# EAGLE schematic protoCtrl (EAGLE 6.3)
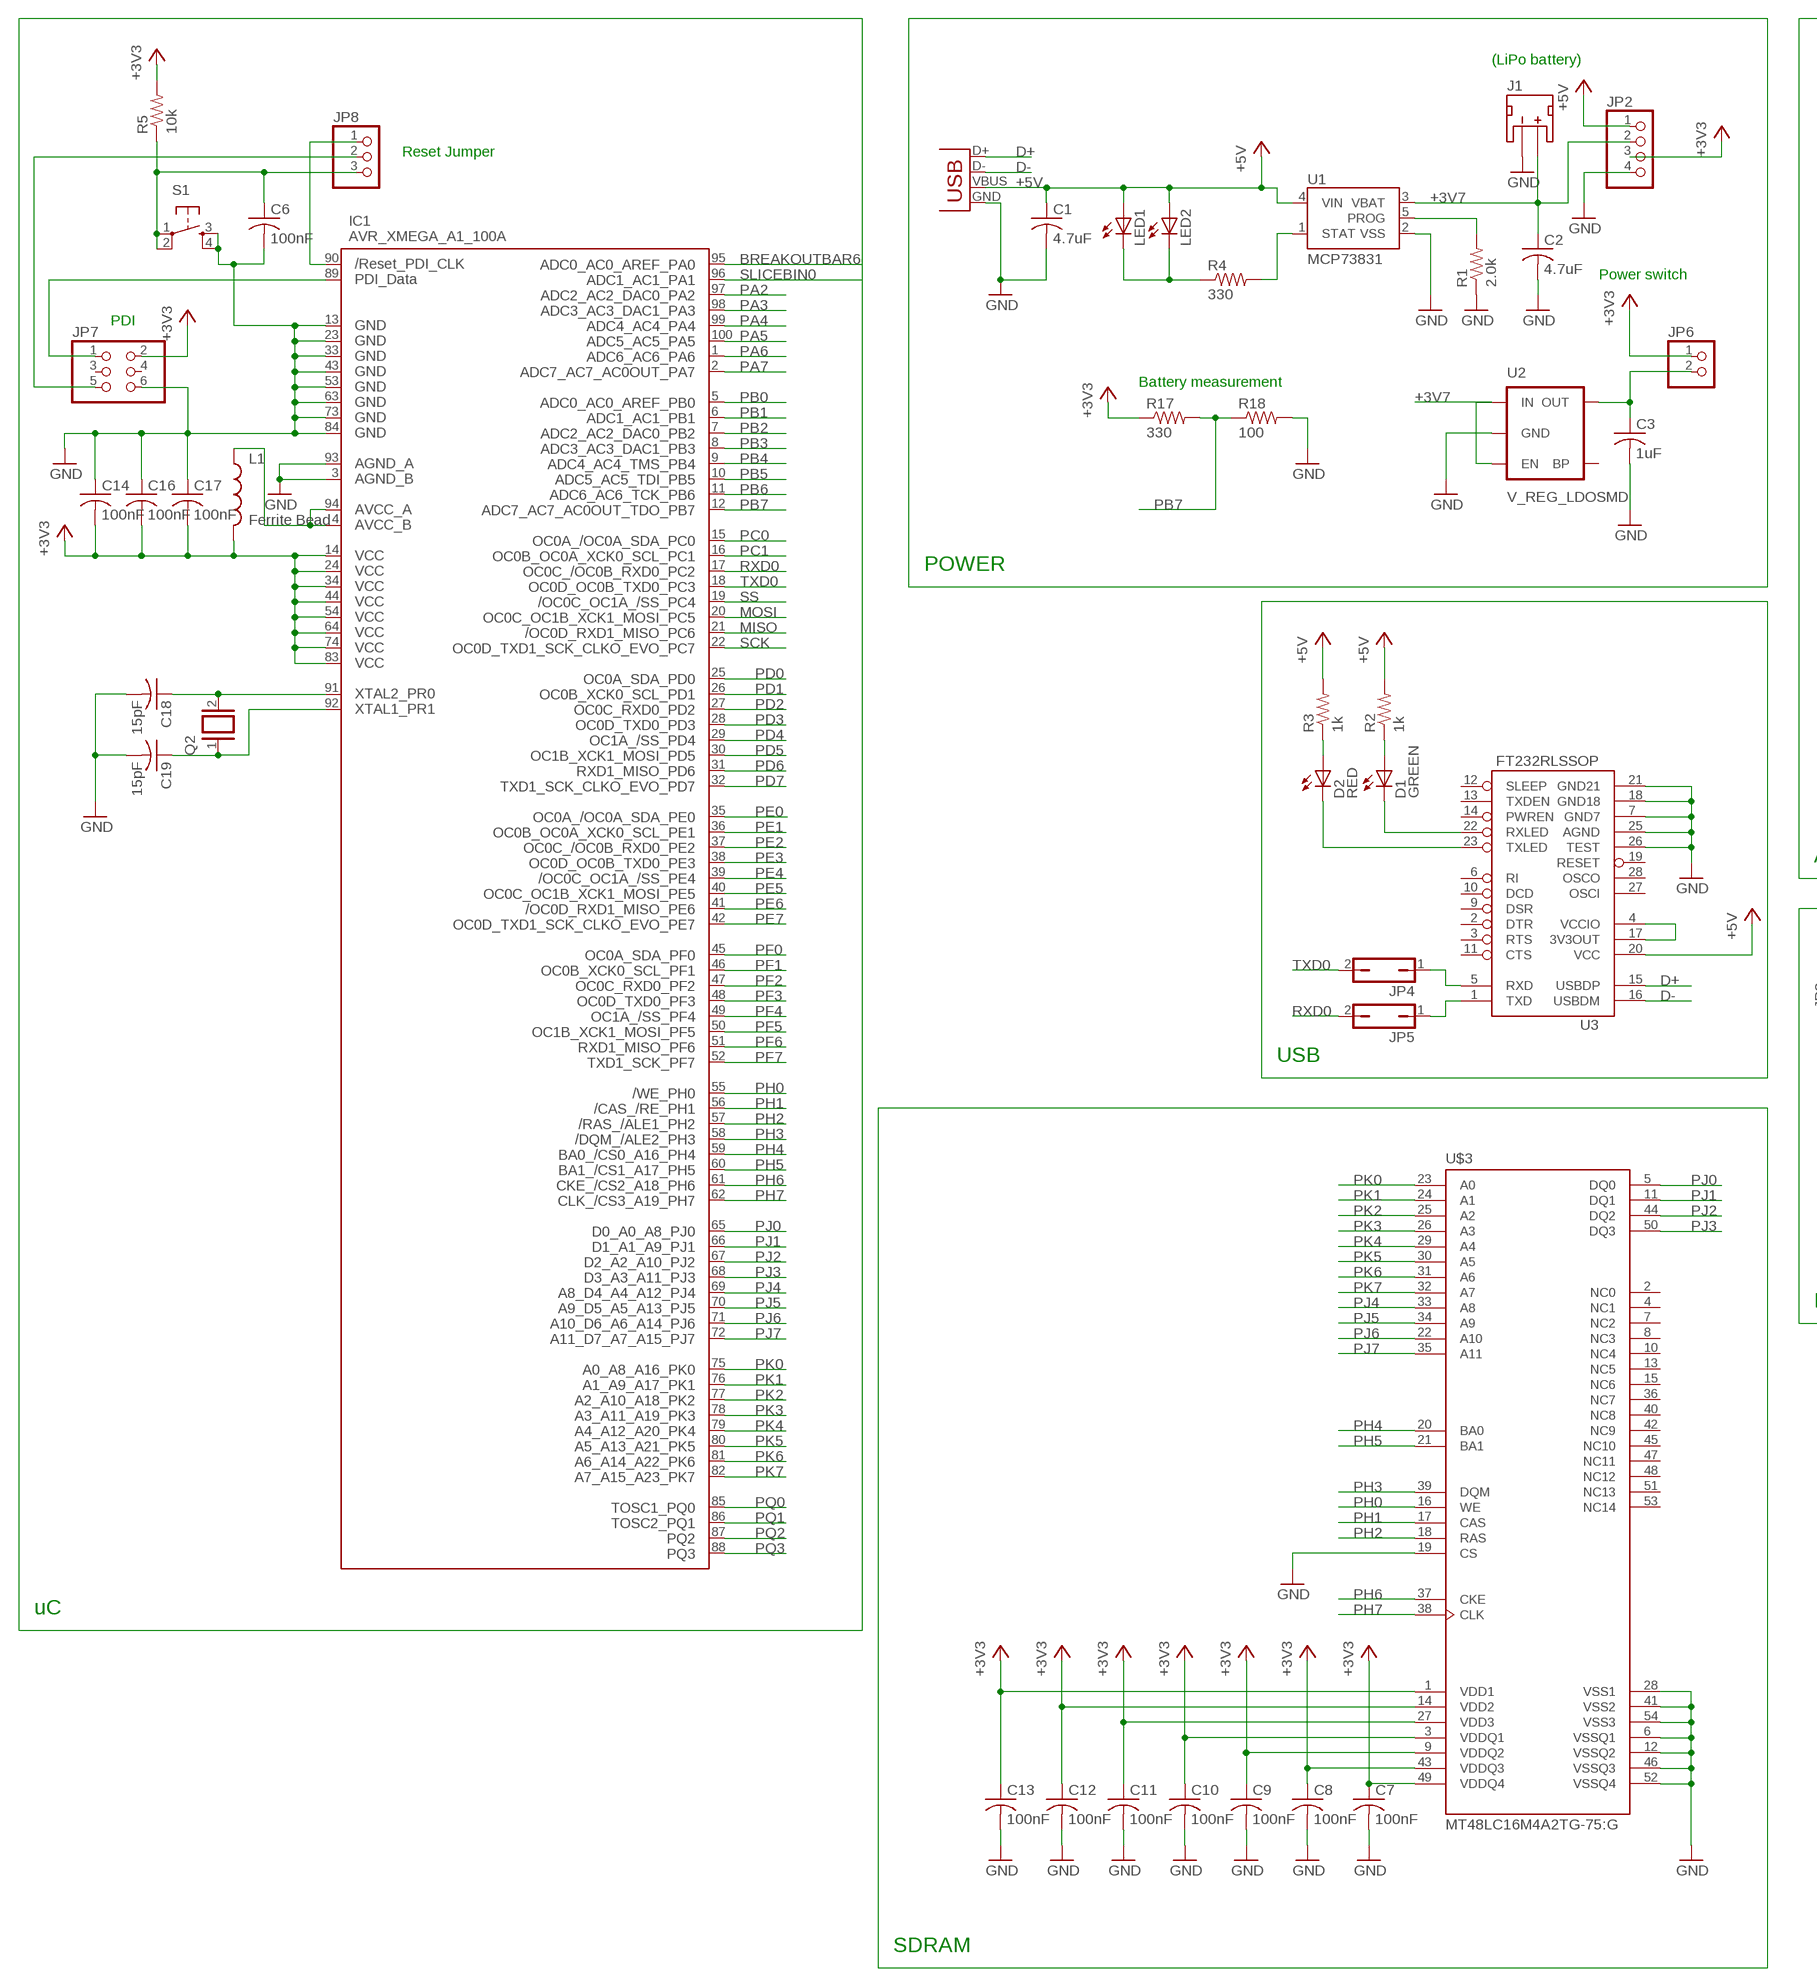
[diagram p0: schematic, sheet 1, part 1 of 2]
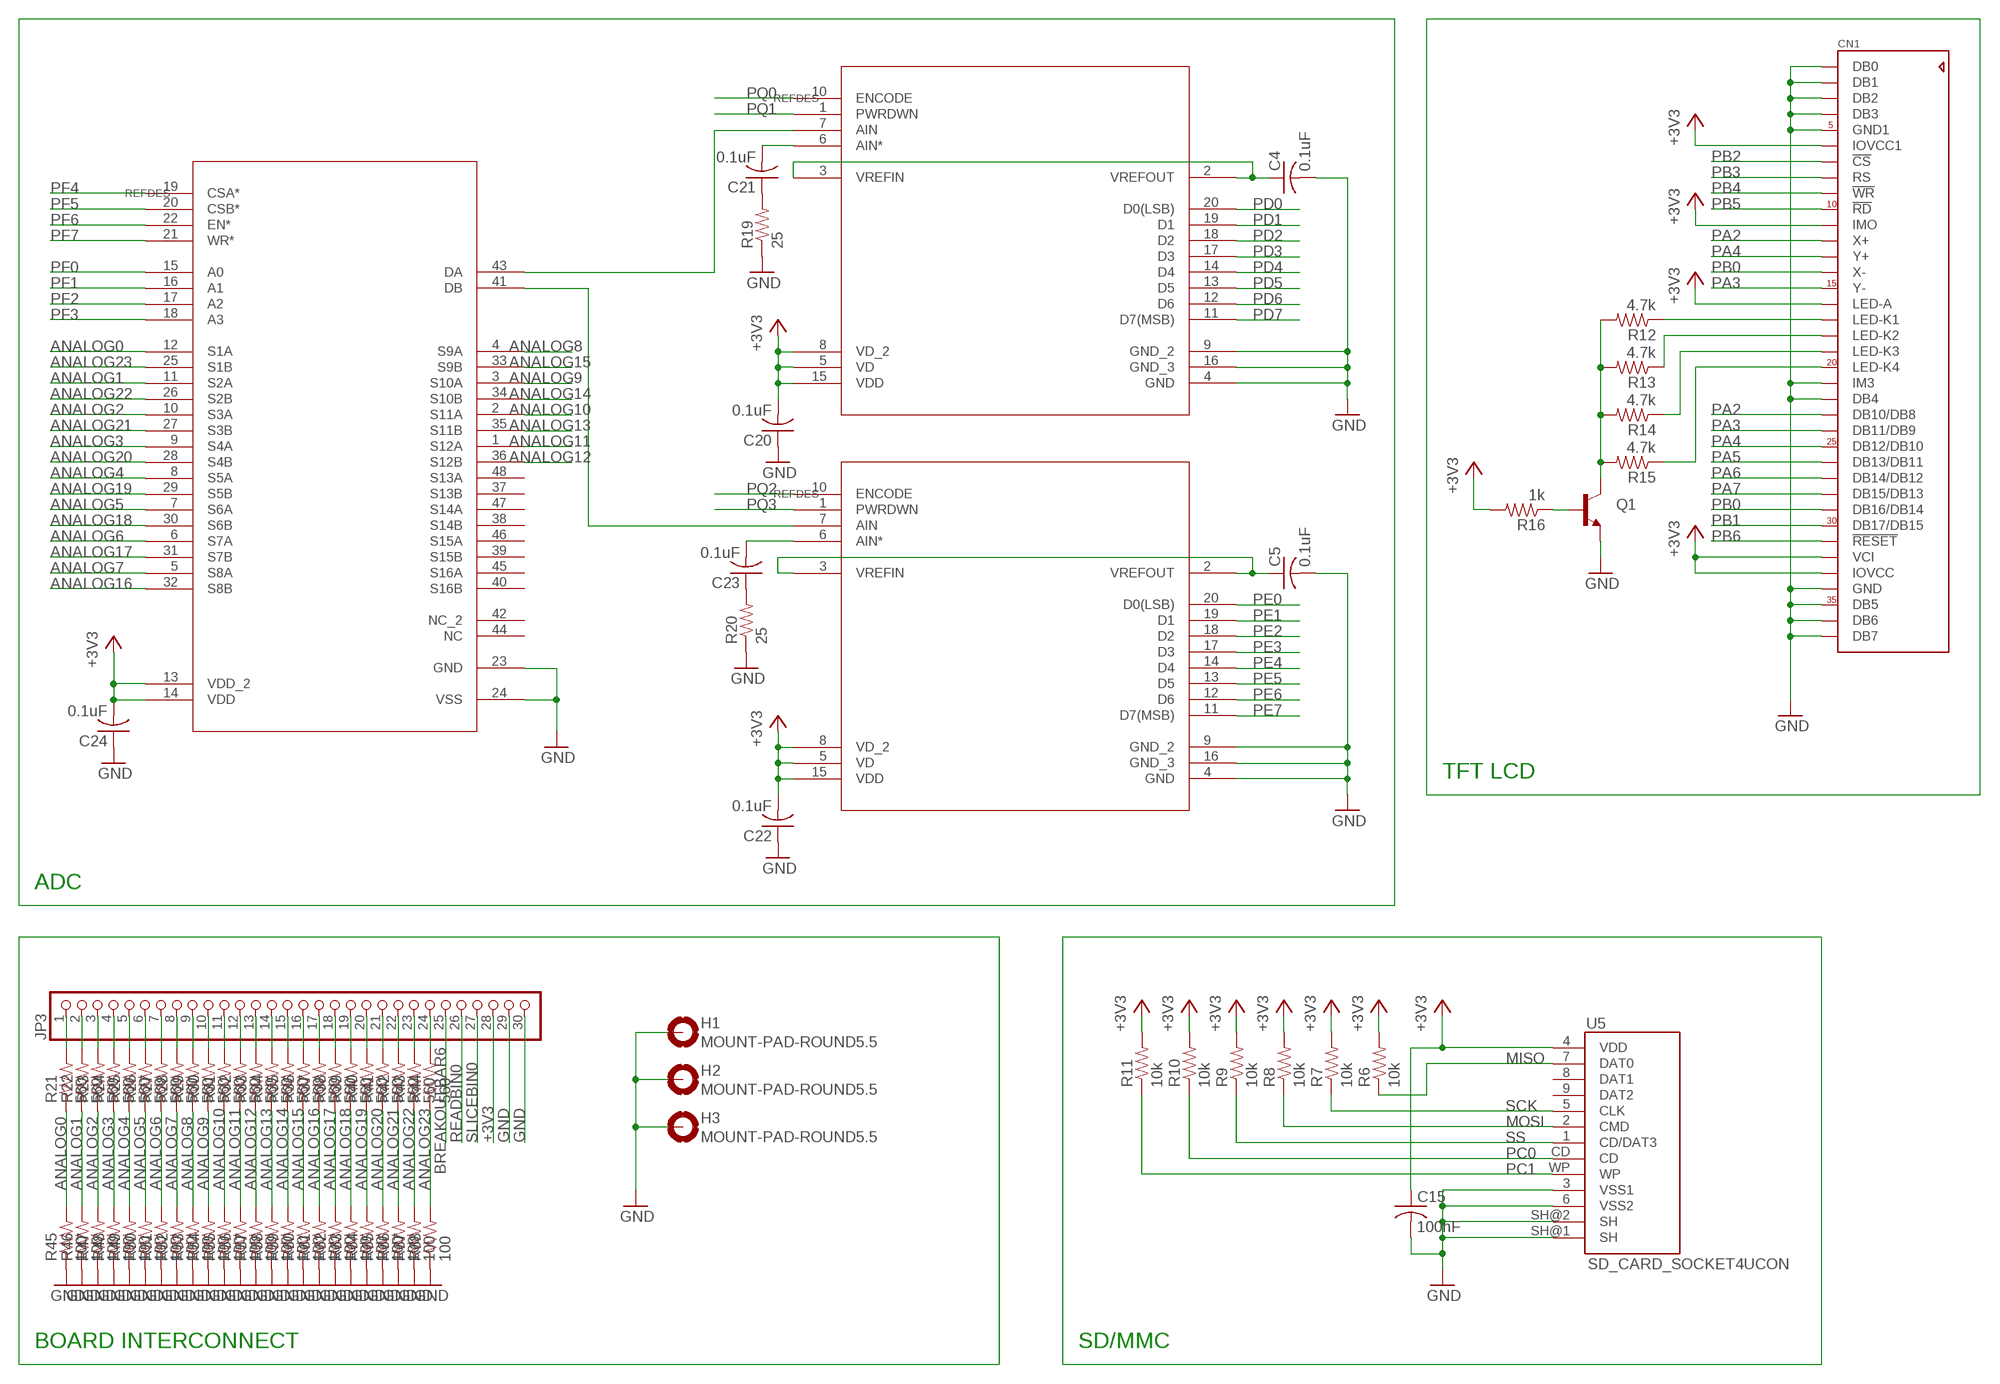
[diagram p1: schematic, sheet 1, part 2 of 2]

## Parts
C1  4.7uF  C-USC0603  [C0603]
C2  4.7uF  C-USC0603  [C0603]
C3  1uF  C-USC0603  [C0603]
C4  0.1uF  C-USC0603  [C0603]
C5  0.1uF  C-USC0603  [C0603]
C6  100nF  C-USC0603  [C0603]
C7  100nF  C-USC0603  [C0603]
C8  100nF  C-USC0603  [C0603]
C9  100nF  C-USC0603  [C0603]
C10  100nF  C-USC0603  [C0603]
C11  100nF  C-USC0603  [C0603]
C12  100nF  C-USC0603  [C0603]
C13  100nF  C-USC0603  [C0603]
C14  100nF  C-USC0603  [C0603]
C15  100nF  C-USC0603  [C0603]
C16  100nF  C-USC0603  [C0603]
C17  100nF  C-USC0603  [C0603]
C18  15pF  C-USC0603  [C0603]
C19  15pF  C-USC0603  [C0603]
C20  0.1uF  C-USC0603  [C0603]
C21  0.1uF  C-USC0603  [C0603]
C22  0.1uF  C-USC0603  [C0603]
C23  0.1uF  C-USC0603  [C0603]
C24  0.1uF  C-USC0603  [C0603]
CN1  ILI9325_LCD1.0MM  [ILI9325_28INCH_TS]
D1  GREEN  LED-GREEN0603  [LED-0603]
D2  RED  LED-RED0603  [LED-0603]
H1  MOUNT-PAD-ROUND5.5  [5,5-PAD]
H2  MOUNT-PAD-ROUND5.5  [5,5-PAD]
H3  MOUNT-PAD-ROUND5.5  [5,5-PAD]
IC1  AVR_XMEGA_A1_100A  [TQFP100]
J1  JST_2MM_MALE  [JST-2-SMD]
JP1  USBSMD  [USB-MINIB]
JP2  PINHD-1X4  [1X04]
JP3  PINHD-1X30  [1X30]
JP4  JP1Q  [JP1]
JP5  JP1Q  [JP1]
JP6  PINHD-1X2  [1X02]
JP7  PINHD-2X3  [2X03]
JP8  PINHD-1X3  [1X03]
L1  Ferrite Bead  INDUCTOR0603  [0603]
LED1  LED1206  [LED-1206]
LED2  LED3MM  [LED3MM]
Q1  TRANSISTOR_NPN"  [SOT223]
Q2  XTAL/S  [QS]
R1  2.0k  2.0KOHM1/10W5%(0603)  [0402-RES]
R2  1k  1K-1%  [0402-RES]
R3  1k  1K-1%  [0402-RES]
R4  330  330OHM1/10W1%(0603)  [0402-RES]
R5  10k  2.0KOHM1/10W5%(0603)  [0402-RES]
R6  10k  2.0KOHM1/10W5%(0603)  [0402-RES]
R7  10k  2.0KOHM1/10W5%(0603)  [0402-RES]
R8  10k  2.0KOHM1/10W5%(0603)  [0402-RES]
R9  10k  2.0KOHM1/10W5%(0603)  [0402-RES]
R10  10k  2.0KOHM1/10W5%(0603)  [0402-RES]
R11  10k  2.0KOHM1/10W5%(0603)  [0402-RES]
R12  4.7k  2.0KOHM1/10W5%(0603)  [0402-RES]
R13  4.7k  2.0KOHM1/10W5%(0603)  [0402-RES]
R14  4.7k  2.0KOHM1/10W5%(0603)  [0402-RES]
R15  4.7k  2.0KOHM1/10W5%(0603)  [0402-RES]
R16  1k  2.0KOHM1/10W5%(0603)  [0402-RES]
R17  330  330OHM1/10W1%(0603)  [0402-RES]
R18  100  330OHM1/10W1%(0603)  [0402-RES]
R19  25  330OHM1/10W1%(0603)  [0402-RES]
R20  25  330OHM1/10W1%(0603)  [0402-RES]
R21  560  330OHM1/10W1%(0603)  [0402-RES]
R22  560  330OHM1/10W1%(0603)  [0402-RES]
R23  560  330OHM1/10W1%(0603)  [0402-RES]
R24  560  330OHM1/10W1%(0603)  [0402-RES]
R25  560  330OHM1/10W1%(0603)  [0402-RES]
R26  560  330OHM1/10W1%(0603)  [0402-RES]
R27  560  330OHM1/10W1%(0603)  [0402-RES]
R28  560  330OHM1/10W1%(0603)  [0402-RES]
R29  560  330OHM1/10W1%(0603)  [0402-RES]
R30  560  330OHM1/10W1%(0603)  [0402-RES]
R31  560  330OHM1/10W1%(0603)  [0402-RES]
R32  560  330OHM1/10W1%(0603)  [0402-RES]
R33  560  330OHM1/10W1%(0603)  [0402-RES]
R34  560  330OHM1/10W1%(0603)  [0402-RES]
R35  560  330OHM1/10W1%(0603)  [0402-RES]
R36  560  330OHM1/10W1%(0603)  [0402-RES]
R37  560  330OHM1/10W1%(0603)  [0402-RES]
R38  560  330OHM1/10W1%(0603)  [0402-RES]
R39  560  330OHM1/10W1%(0603)  [0402-RES]
R40  560  330OHM1/10W1%(0603)  [0402-RES]
R41  560  330OHM1/10W1%(0603)  [0402-RES]
R42  560  330OHM1/10W1%(0603)  [0402-RES]
R43  560  330OHM1/10W1%(0603)  [0402-RES]
R44  560  330OHM1/10W1%(0603)  [0402-RES]
R45  100  330OHM1/10W1%(0603)  [0402-RES]
R46  100  330OHM1/10W1%(0603)  [0402-RES]
R47  100  330OHM1/10W1%(0603)  [0402-RES]
R48  100  330OHM1/10W1%(0603)  [0402-RES]
R49  100  330OHM1/10W1%(0603)  [0402-RES]
R50  100  330OHM1/10W1%(0603)  [0402-RES]
R51  100  330OHM1/10W1%(0603)  [0402-RES]
R52  100  330OHM1/10W1%(0603)  [0402-RES]
R53  100  330OHM1/10W1%(0603)  [0402-RES]
R54  100  330OHM1/10W1%(0603)  [0402-RES]
R55  100  330OHM1/10W1%(0603)  [0402-RES]
R56  100  330OHM1/10W1%(0603)  [0402-RES]
R57  100  330OHM1/10W1%(0603)  [0402-RES]
R58  100  330OHM1/10W1%(0603)  [0402-RES]
R59  100  330OHM1/10W1%(0603)  [0402-RES]
R60  100  330OHM1/10W1%(0603)  [0402-RES]
R61  100  330OHM1/10W1%(0603)  [0402-RES]
R62  100  330OHM1/10W1%(0603)  [0402-RES]
R63  100  330OHM1/10W1%(0603)  [0402-RES]
R64  100  330OHM1/10W1%(0603)  [0402-RES]
R65  100  330OHM1/10W1%(0603)  [0402-RES]
R66  100  330OHM1/10W1%(0603)  [0402-RES]
R67  100  330OHM1/10W1%(0603)  [0402-RES]
R68  100  330OHM1/10W1%(0603)  [0402-RES]
S1  TAC_SWITCHPTH  [TACTILE-PTH]
U1  MCP73831  [SOT23-5]
U2  V_REG_LDOSMD  [SOT23-5]
U3  FT232RLSSOP  [SSOP28DB]
U4  ADG726BSUZ  [SU_48]
U5  SD_CARD_SOCKET4UCON  [SDCARD_4UCONN]
U6  AD9283BRSZ-80REAL  [SSOP20]
U7  AD9283BRSZ-80REAL  [SSOP20]
U$3  MT48LC16M4A2TG-75:G  [TSOP54-400]

## Nets
+3V3: C7.1 C8.1 C9.1 C10.1 C11.1 C12.1 C13.1 C14.2 C15.1 C16.2 C17.2 C20.2 C22.2 C24.2 CN1.6(IOVCC1) CN1.11(IMO) CN1.16(LED-A) CN1.32(VCI) CN1.33(IOVCC) IC1.14(VCC1) IC1.24(VCC2) IC1.34(VCC3) IC1.44(VCC4) IC1.54(VCC5) IC1.64(VCC6) IC1.74(VCC7) IC1.83(VCC8) JP2.3 JP3.28 JP6.1 JP7.2 L1.2 R5.2 R6.2 R7.2 R8.2 R9.2 R10.2 R11.2 R16.2 R17.1 U4.13(VDD_2) U4.14(VDD) U5.4(VDD) U6.5(VD) U6.8(VD_2) U6.15(VDD) U7.5(VD) U7.8(VD_2) U7.15(VDD) U$3.1(VDD1) U$3.3(VDDQ1) U$3.9(VDDQ2) U$3.14(VDD2) U$3.27(VDD3) U$3.43(VDDQ3) U$3.49(VDDQ4)
+3V7: C2.1 J1.2(+) JP2.2 U1.3(VBAT) U2.1(IN) U2.3(EN)
+5V: C1.1 JP1.VBUS JP2.1 LED1.A LED2.A R2.2 R3.2 U1.4(VIN) U3.20(VCC)
ANALOG0: R21.1 R45.2 U4.12(S1A)
ANALOG1: R22.1 R46.2 U4.11(S2A)
ANALOG2: R23.1 R47.2 U4.10(S3A)
ANALOG3: R24.1 R48.2 U4.9(S4A)
ANALOG4: R25.1 R49.2 U4.8(S5A)
ANALOG5: R26.1 R50.2 U4.7(S6A)
ANALOG6: R27.1 R51.2 U4.6(S7A)
ANALOG7: R28.1 R52.2 U4.5(S8A)
ANALOG8: R29.1 R53.2 U4.4(S9A)
ANALOG9: R30.1 R54.2 U4.3(S10A)
ANALOG10: R31.1 R55.2 U4.2(S11A)
ANALOG11: R32.1 R56.2 U4.1(S12A)
ANALOG12: R33.1 R57.2 U4.36(S12B)
ANALOG13: R34.1 R58.2 U4.35(S11B)
ANALOG14: R35.1 R59.2 U4.34(S10B)
ANALOG15: R36.1 R60.2 U4.33(S9B)
ANALOG16: R37.1 R61.2 U4.32(S8B)
ANALOG17: R38.1 R62.2 U4.31(S7B)
ANALOG18: R39.1 R63.2 U4.30(S6B)
ANALOG19: R40.1 R64.2 U4.29(S5B)
ANALOG20: R41.1 R65.2 U4.28(S4B)
ANALOG21: R42.1 R66.2 U4.27(S3B)
ANALOG22: R43.1 R67.2 U4.26(S2B)
ANALOG23: R44.1 R68.2 U4.25(S1B)
BREAKOUTBAR6: IC1.95(PA0) JP3.25
D+: JP1.D+ U3.15(USBDP)
D-: JP1.D- U3.16(USBDM)
GND [GND]: C1.2 C2.2 C3.2 C4.2 C5.2 C6.2 C7.2 C8.2 C9.2 C10.2 C11.2 C12.2 C13.2 C14.1 C15.2 C16.1 C17.1 C18.2 C19.2 C20.1 C22.1 C24.1 CN1.1(DB0) CN1.2(DB1) CN1.3(DB2) CN1.4(DB3) CN1.5(GND1) CN1.21(IM3) CN1.22(DB4) CN1.34(GND) CN1.35(DB5) CN1.36(DB6) CN1.37(DB7) H1.B5,5(MOUNT) H2.B5,5(MOUNT) H3.B5,5(MOUNT) IC1.3(AGND_B) IC1.13(GND1) IC1.23(GND2) IC1.33(GND3) IC1.43(GND4) IC1.53(GND5) IC1.63(GND6) IC1.73(GND7) IC1.84(GND8) IC1.93(AGND_A) J1.1(-) JP1.GND JP2.4 JP3.29 JP3.30 JP7.6 Q1.3(E) R1.1 R18.2 R19.1 R20.1 R45.1 R46.1 R47.1 R48.1 R49.1 R50.1 R51.1 R52.1 R53.1 R54.1 R55.1 R56.1 R57.1 R58.1 R59.1 R60.1 R61.1 R62.1 R63.1 R64.1 R65.1 R66.1 R67.1 R68.1 S1.3 S1.4 U1.2(VSS) U2.2(GND) U3.7(GND7) U3.18(GND18) U3.21(GND21) U3.25(AGND) U3.26(TEST) U4.23(GND) U4.24(VSS) U5.3(VSS1) U5.6(VSS2) U5.SH@1(SH) U5.SH@2(SH) U6.4(GND) U6.9(GND_2) U6.16(GND_3) U7.4(GND) U7.9(GND_2) U7.16(GND_3) U$3.6(VSSQ1) U$3.12(VSSQ2) U$3.19(CS) U$3.28(VSS1) U$3.41(VSS2) U$3.46(VSSQ3) U$3.52(VSSQ4) U$3.54(VSS3)
MISO: IC1.21(PC6) R6.1 U5.7(DAT0)
MOSI: IC1.20(PC5) R8.1 U5.2(CMD)
N$1: D1.C U3.22(RXLED)
N$2: LED1.C LED2.K(C) R4.1
N$3: D2.C U3.23(TXLED)
N$4: R4.2 U1.1(STAT)
N$5: D2.A R3.1
N$6: R1.2 U1.5(PROG)
N$7: D1.A R2.1
N$8: JP5.1 U3.1(TXD)
N$9: U3.4(VCCIO) U3.17(3V3OUT)
N$10: U4.43(DA) U6.7(AIN)
N$11: U4.41(DB) U7.7(AIN)
N$12: JP4.1 U3.5(RXD)
N$13: JP7.5 JP8.2
N$14: C3.1 JP6.2 U2.5(OUT)
N$15: IC1.89(PDI_DATA) JP7.1
N$16: CN1.17(LED-K1) R12.1
N$17: CN1.18(LED-K2) R13.1
N$18: CN1.19(LED-K3) R14.1
N$19: CN1.20(LED-K4) R15.1
N$20: Q1.2(C) R12.2 R13.2 R14.2 R15.2
N$21: Q1.1(B) R16.1
N$22: IC1.4(AVCC_B) IC1.94(AVCC_A) L1.1
N$23: IC1.90(RESET) JP8.1
N$24: C6.1 JP8.3 R5.1 S1.1 S1.2
N$25: C18.1 IC1.91(PR0) Q2.2
N$26: C19.1 IC1.92(PR1) Q2.1
N$28: C4.1 U6.2(VREFOUT) U6.3(VREFIN)
N$29: C21.1 R19.2
N$30: C5.1 U7.2(VREFOUT) U7.3(VREFIN)
N$31: C21.2 U6.6(AIN*)
N$32: C23.2 U7.6(AIN*)
N$33: C23.1 R20.2
N$34: JP3.1 R21.2
N$35: JP3.2 R22.2
N$36: JP3.24 R44.2
N$59: JP3.3 R23.2
N$60: JP3.4 R24.2
N$61: JP3.5 R25.2
N$62: JP3.6 R26.2
N$63: JP3.7 R27.2
N$64: JP3.8 R28.2
N$65: JP3.9 R29.2
N$66: JP3.10 R30.2
N$67: JP3.11 R31.2
N$68: JP3.12 R32.2
N$69: JP3.13 R33.2
N$70: JP3.14 R34.2
N$71: JP3.15 R35.2
N$72: JP3.16 R36.2
N$73: JP3.17 R37.2
N$74: JP3.18 R38.2
N$75: JP3.19 R39.2
N$76: JP3.20 R40.2
N$77: JP3.21 R41.2
N$78: JP3.22 R42.2
N$79: JP3.23 R43.2
PA2: CN1.12(X+) CN1.23(DB10/DB8) IC1.97(PA2)
PA3: CN1.15(Y-) CN1.24(DB11/DB9) IC1.98(PA3)
PA4: CN1.13(Y+) CN1.25(DB12/DB10) IC1.99(PA4)
PA5: CN1.26(DB13/DB11) IC1.100(PA5)
PA6: CN1.27(DB14/DB12) IC1.1(PA6)
PA7: CN1.28(DB15/DB13) IC1.2(PA7)
PB0: CN1.14(X-) CN1.29(DB16/DB14) IC1.5(PB0)
PB1: CN1.30(DB17/DB15) IC1.6(PB1)
PB2: CN1.7(!CS) IC1.7(PB2)
PB3: CN1.8(RS) IC1.8(PB3)
PB4: CN1.9(!WR) IC1.9(PB4)
PB5: CN1.10(!RD) IC1.10(PB5)
PB6: CN1.31(!RESET) IC1.11(PB6)
PB7: IC1.12(PB7) R17.2 R18.1
PC0: IC1.15(PC0) R10.1 U5.CD
PC1: IC1.16(PC1) R11.1 U5.WP
PD0: IC1.25(PD0) U6.20(D0(LSB))
PD1: IC1.26(PD1) U6.19(D1)
PD2: IC1.27(PD2) U6.18(D2)
PD3: IC1.28(PD3) U6.17(D3)
PD4: IC1.29(PD4) U6.14(D4)
PD5: IC1.30(PD5) U6.13(D5)
PD6: IC1.31(PD6) U6.12(D6)
PD7: IC1.32(PD7) U6.11(D7(MSB))
PE0: IC1.35(PE0) U7.20(D0(LSB))
PE1: IC1.36(PE1) U7.19(D1)
PE2: IC1.37(PE2) U7.18(D2)
PE3: IC1.38(PE3) U7.17(D3)
PE4: IC1.39(PE4) U7.14(D4)
PE5: IC1.40(PE5) U7.13(D5)
PE6: IC1.41(PE6) U7.12(D6)
PE7: IC1.42(PE7) U7.11(D7(MSB))
PF0: IC1.45(PF0) U4.15(A0)
PF1: IC1.46(PF1) U4.16(A1)
PF2: IC1.47(PF2) U4.17(A2)
PF3: IC1.48(PF3) U4.18(A3)
PF4: IC1.49(PF4) U4.19(CSA*)
PF5: IC1.50(PF5) U4.20(CSB*)
PF6: IC1.51(PF6) U4.22(EN*)
PF7: IC1.52(PF7) U4.21(WR*)
PH0: IC1.55(PH0) U$3.16(WE)
PH1: IC1.56(PH1) U$3.17(CAS)
PH2: IC1.57(PH2) U$3.18(RAS)
PH3: IC1.58(PH3) U$3.39(DQM)
PH4: IC1.59(PH4) U$3.20(BA0)
PH5: IC1.60(PH5) U$3.21(BA1)
PH6: IC1.61(PH6) U$3.37(CKE)
PH7: IC1.62(PH7) U$3.38(CLK)
PJ0: IC1.65(PJ0) U$3.5(DQ0)
PJ1: IC1.66(PJ1) U$3.11(DQ1)
PJ2: IC1.67(PJ2) U$3.44(DQ2)
PJ3: IC1.68(PJ3) U$3.50(DQ3)
PJ4: IC1.69(PJ4) U$3.33(A8)
PJ5: IC1.70(PJ5) U$3.34(A9)
PJ6: IC1.71(PJ6) U$3.22(A10)
PJ7: IC1.72(PJ7) U$3.35(A11)
PK0: IC1.75(PK0) U$3.23(A0)
PK1: IC1.76(PK1) U$3.24(A1)
PK2: IC1.77(PK2) U$3.25(A2)
PK3: IC1.78(PK3) U$3.26(A3)
PK4: IC1.79(PK4) U$3.29(A4)
PK5: IC1.80(PK5) U$3.30(A5)
PK6: IC1.81(PK6) U$3.31(A6)
PK7: IC1.82(PK7) U$3.32(A7)
PQ0: IC1.85(PQ0) U6.10(ENCODE)
PQ1: IC1.86(PQ1) U6.1(PWRDWN)
PQ2: IC1.87(PQ2) U7.10(ENCODE)
PQ3: IC1.88(PQ3) U7.1(PWRDWN)
READBIN0: JP3.26
RXD0: IC1.17(PC2) JP5.2
SCK: IC1.22(PC7) R7.1 U5.5(CLK)
SLICEBIN0: IC1.96(PA1) JP3.27
SS: IC1.19(PC4) R9.1 U5.1(CD/DAT3)
TXD0: IC1.18(PC3) JP4.2
Unconnected: J1.NC1(PAD1) J1.NC2(PAD2) JP7.3 JP7.4 U2.4(BP) U3.2(DTR) U3.3(RTS) U3.6(RI) U3.9(DSR) U3.10(DCD) U3.11(CTS) U3.12(SLEEP) U3.13(TXDEN) U3.14(PWREN) U3.19(RESET) U3.27(OSCI) U3.28(OSCO) U4.37(S13B) U4.38(S14B) U4.39(S15B) U4.40(S16B) U4.42(NC_2) U4.44(NC) U4.45(S16A) U4.46(S15A) U4.47(S14A) U4.48(S13A) U5.8(DAT1) U5.9(DAT2) U$3.2(NC0) U$3.4(NC1) U$3.7(NC2) U$3.8(NC3) U$3.10(NC4) U$3.13(NC5) U$3.15(NC6) U$3.36(NC7) U$3.40(NC8) U$3.42(NC9) U$3.45(NC10) U$3.47(NC11) U$3.48(NC12) U$3.51(NC13) U$3.53(NC14)

## Notes on the sheet
- (LiPo battery)
- Reset Jumper
- Power switch
- PDI
- Battery measurement
- POWER
- TFT LCD
- ADC
- USB
- BOARD INTERCONNECT | SD/MMC
- uC
- SDRAM

## Library data of the parts
C1-C17 C20-C24 = rcl:C-US: CAPACITOR, American symbol
C18 C19 = resistor:C-US: CAPACITOR, American symbol
CN1 = adafruit:ILI9325_LCD: 2.8" ILI9325-based TFT LCD w/Integrated Touch Screen
D1 = SparkFun-LED:LED-GREEN: Various green LEDs 0603- DIO-00821 LARGE- DIO-00862 LILYPAD- DIO-09910; PROD_ID: DIO-00821
D2 = SparkFun-LED:LED-RED: Assorted Red LEDs LilyPad 1206- DIO-09912 1206- DIO-00809 0603- DIO-00819; PROD_ID: DIO-00819
H1-H3 = holes:MOUNT-PAD-ROUND: MOUNTING PAD, round
IC1 = xmega:AVR_XMEGA_A1_: Device for Atmel AVR XMEGA A1 Series
J1 = SparkFun-Connectors:JST_2MM_MALE: Mates to single-cell LiPo batteries. CONN-08352; PROD_ID: CONN-08352
JP1 = SparkFun-Connectors:USB: USB Connectors USB-B-PTH is fully proven SKU : PRT-00139/CONN-08278 USB-miniB is fully proven SKU : PRT-00587 USB-A-PCB is untested. USB-A-H is throughly reviewed, but untested. Spark Fun Electronics SKU : PRT-00437 USB-B-SMT is throughly reviewed, but untested. Needs silkscreen touching up. USB-A-S has not been used/tested USB-MB-H has not been used/tested USB-MICROB has been used. CONN-09505
JP2 = pinhead:PINHD-1X4: PIN HEADER
JP3 = pinhead:PINHD-1X30: PIN HEADER
JP4 JP5 = jumper:JP1Q: JUMPER
JP6 = pinhead:PINHD-1X2: PIN HEADER
JP7 = pinhead:PINHD-2X3: PIN HEADER
JP8 = pinhead:PINHD-1X3: PIN HEADER
L1 = SparkFun-Passives:INDUCTOR: Inductors Basic Inductor/Choke - 0603 and 1206. Footprints are not proven and vary greatly between part numbers.
LED1 LED2 = SparkFun-LED:LED: LEDs Standard schematic elements and footprints for 5mm, 3mm, 1206, and 0603 sized LEDs. 5mm - Spark Fun Electronics SKU : COM-00529 (and others)
Q1 = SparkFun-DiscreteSemi:TRANSISTOR_NPN: Generic NPN BJT. MMBT2222 is the common NPN we use. Double check against datasheet- not all devices are the same!
Q2 = special:XTAL/S: CRYSTAL
R1 = SparkFun-Resistors:2.0KOHM1/10W5%(0603): RES-08296; PROD_ID: RES-08296
R2 R3 = SparkFun-Resistors:1K-1%: 1k-ohm SMT 1/10W - 1% (0603) RES-07856; PROD_ID: RES-07856
R4 R17 = SparkFun-Resistors:330OHM1/10W1%(0603): RES-00818; PROD_ID: RES-00818
R5-R16 = SparkFun-Resistors:2.0KOHM1/10W5%(0603): RES-08296; PROD_ID: RES-08296; VALUE: 2.0k
R18-R68 = SparkFun-Resistors:330OHM1/10W1%(0603): RES-00818; PROD_ID: RES-00818; VALUE: 330
S1 = SparkFun-Electromechanical:TAC_SWITCH: Momentary Switch Button commonly used for reset or general input. Spark Fun Electronics SKU : COM-00097 SMT- SWCH-08247
U1 = SparkFun-PowerIC:MCP73831: Miniature single cell, fully integrated Li-Ion, Li-polymer charge management controller http://ww1.microchip.com/downloads/en/DeviceDoc/21984a.pdf IC-09995; PROD_ID: IC-09995
U2 = SparkFun-PowerIC:V_REG_LDO: Voltage Regulator LDO Standard 150mA LDO voltage regulator in SOT-23 layout. Micrel part MIC5205. BP (by-pass) pin is used to lower output noise with 470pF cap.
U3 = SparkFun-DigitalIC:FT232RL: USB UART FT232RL 4th Generation USB UART (USB <-> Serial) Controller. Spark Fun Electronics SKU : COM-00650 Production SKU IC-00870; PROD_ID: IC-00870
U4 = custom-lfc-mux:ADG726BSUZ
U5 = SparkFun-Connectors:SD_CARD_SOCKET: SD Memory Card Connector, push-push normal type, CD enable, WP enable
U6 U7 = custom-lfc:AD9283BRSZ-80
U$3 = custom-lfc:MT48LC16M4A2: IC SDRAM 64MBIT 133MHZ